# Altium schematic sheet 0-OverView.SCHDOC
size A4
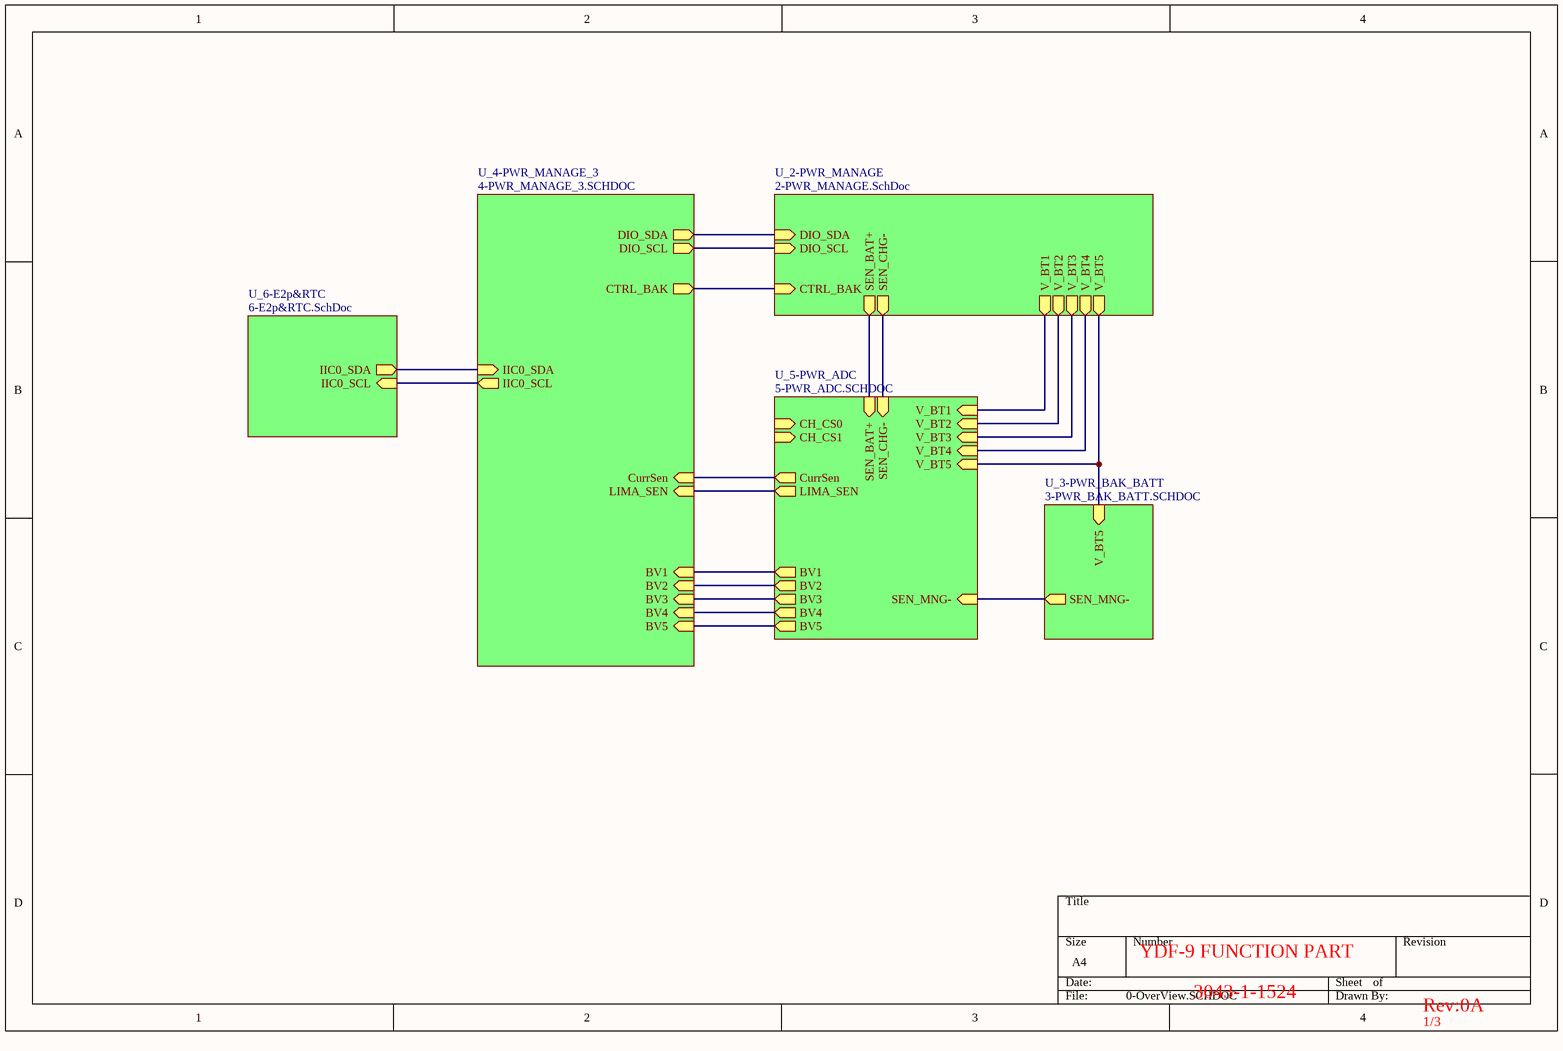
[diagram p0: 0-OverView.SCHDOC]

## Sub-sheets
U_2-PWR_MANAGE = 2-PWR_MANAGE.SchDoc: V_BT1 (out), V_BT2 (out), V_BT3 (out), V_BT4 (out), DIO_SDA (in), DIO_SCL (in), V_BT5 (out), SEN_BAT+ (out), SEN_CHG- (out), CTRL_BAK (in)
U_3-PWR_BAK_BATT = 3-PWR_BAK_BATT.SCHDOC: SEN_MNG- (out), V_BT5 (in)
U_4-PWR_MANAGE_3 = 4-PWR_MANAGE_3.SCHDOC: DIO_SDA (out), DIO_SCL (out), BV2 (in), BV1 (in), BV3 (in), BV4 (in), IIC0_SDA (in), IIC0_SCL (out), LIMA_SEN (in), CurrSen (in), BV5 (in), CTRL_BAK (out)
U_5-PWR_ADC = 5-PWR_ADC.SCHDOC: V_BT5 (in), V_BT3 (in), BV2 (out), CurrSen (out), V_BT2 (in), V_BT4 (in), BV4 (out), CH_CS1 (in), BV1 (out), SEN_CHG- (in), SEN_MNG- (in), SEN_BAT+ (in), BV3 (out), CH_CS0 (in), V_BT1 (in), LIMA_SEN (out), BV5 (out)
U_6-E2p&RTC = 6-E2p&RTC.SchDoc: IIC0_SCL (in), IIC0_SDA (out)

## Nets
(unnamed): sheet U_2-PWR_MANAGE/V_BT1, sheet U_5-PWR_ADC/V_BT1
(unnamed): sheet U_2-PWR_MANAGE/V_BT2, sheet U_5-PWR_ADC/V_BT2
(unnamed): sheet U_2-PWR_MANAGE/V_BT3, sheet U_5-PWR_ADC/V_BT3
(unnamed): sheet U_2-PWR_MANAGE/V_BT4, sheet U_5-PWR_ADC/V_BT4
(unnamed): sheet U_2-PWR_MANAGE/DIO_SDA, sheet U_4-PWR_MANAGE_3/DIO_SDA
(unnamed): sheet U_2-PWR_MANAGE/DIO_SCL, sheet U_4-PWR_MANAGE_3/DIO_SCL
(unnamed): sheet U_2-PWR_MANAGE/V_BT5, sheet U_3-PWR_BAK_BATT/V_BT5, sheet U_5-PWR_ADC/V_BT5
(unnamed): sheet U_2-PWR_MANAGE/SEN_BAT+, sheet U_5-PWR_ADC/SEN_BAT+
(unnamed): sheet U_2-PWR_MANAGE/SEN_CHG-, sheet U_5-PWR_ADC/SEN_CHG-
(unnamed): sheet U_2-PWR_MANAGE/CTRL_BAK, sheet U_4-PWR_MANAGE_3/CTRL_BAK
(unnamed): sheet U_3-PWR_BAK_BATT/SEN_MNG-, sheet U_5-PWR_ADC/SEN_MNG-
(unnamed): sheet U_4-PWR_MANAGE_3/BV2, sheet U_5-PWR_ADC/BV2
(unnamed): sheet U_4-PWR_MANAGE_3/BV1, sheet U_5-PWR_ADC/BV1
(unnamed): sheet U_4-PWR_MANAGE_3/BV3, sheet U_5-PWR_ADC/BV3
(unnamed): sheet U_4-PWR_MANAGE_3/BV4, sheet U_5-PWR_ADC/BV4
(unnamed): sheet U_4-PWR_MANAGE_3/IIC0_SDA, sheet U_6-E2p&RTC/IIC0_SDA
(unnamed): sheet U_4-PWR_MANAGE_3/IIC0_SCL, sheet U_6-E2p&RTC/IIC0_SCL
(unnamed): sheet U_4-PWR_MANAGE_3/LIMA_SEN, sheet U_5-PWR_ADC/LIMA_SEN
(unnamed): sheet U_4-PWR_MANAGE_3/CurrSen, sheet U_5-PWR_ADC/CurrSen
(unnamed): sheet U_4-PWR_MANAGE_3/BV5, sheet U_5-PWR_ADC/BV5

## Notes on the sheet
- YDF-9 FUNCTION PART
- 3043-1-1524
- Rev:0A
- 1/3